# EAGLE design led_driver (EAGLE 6.5.0)
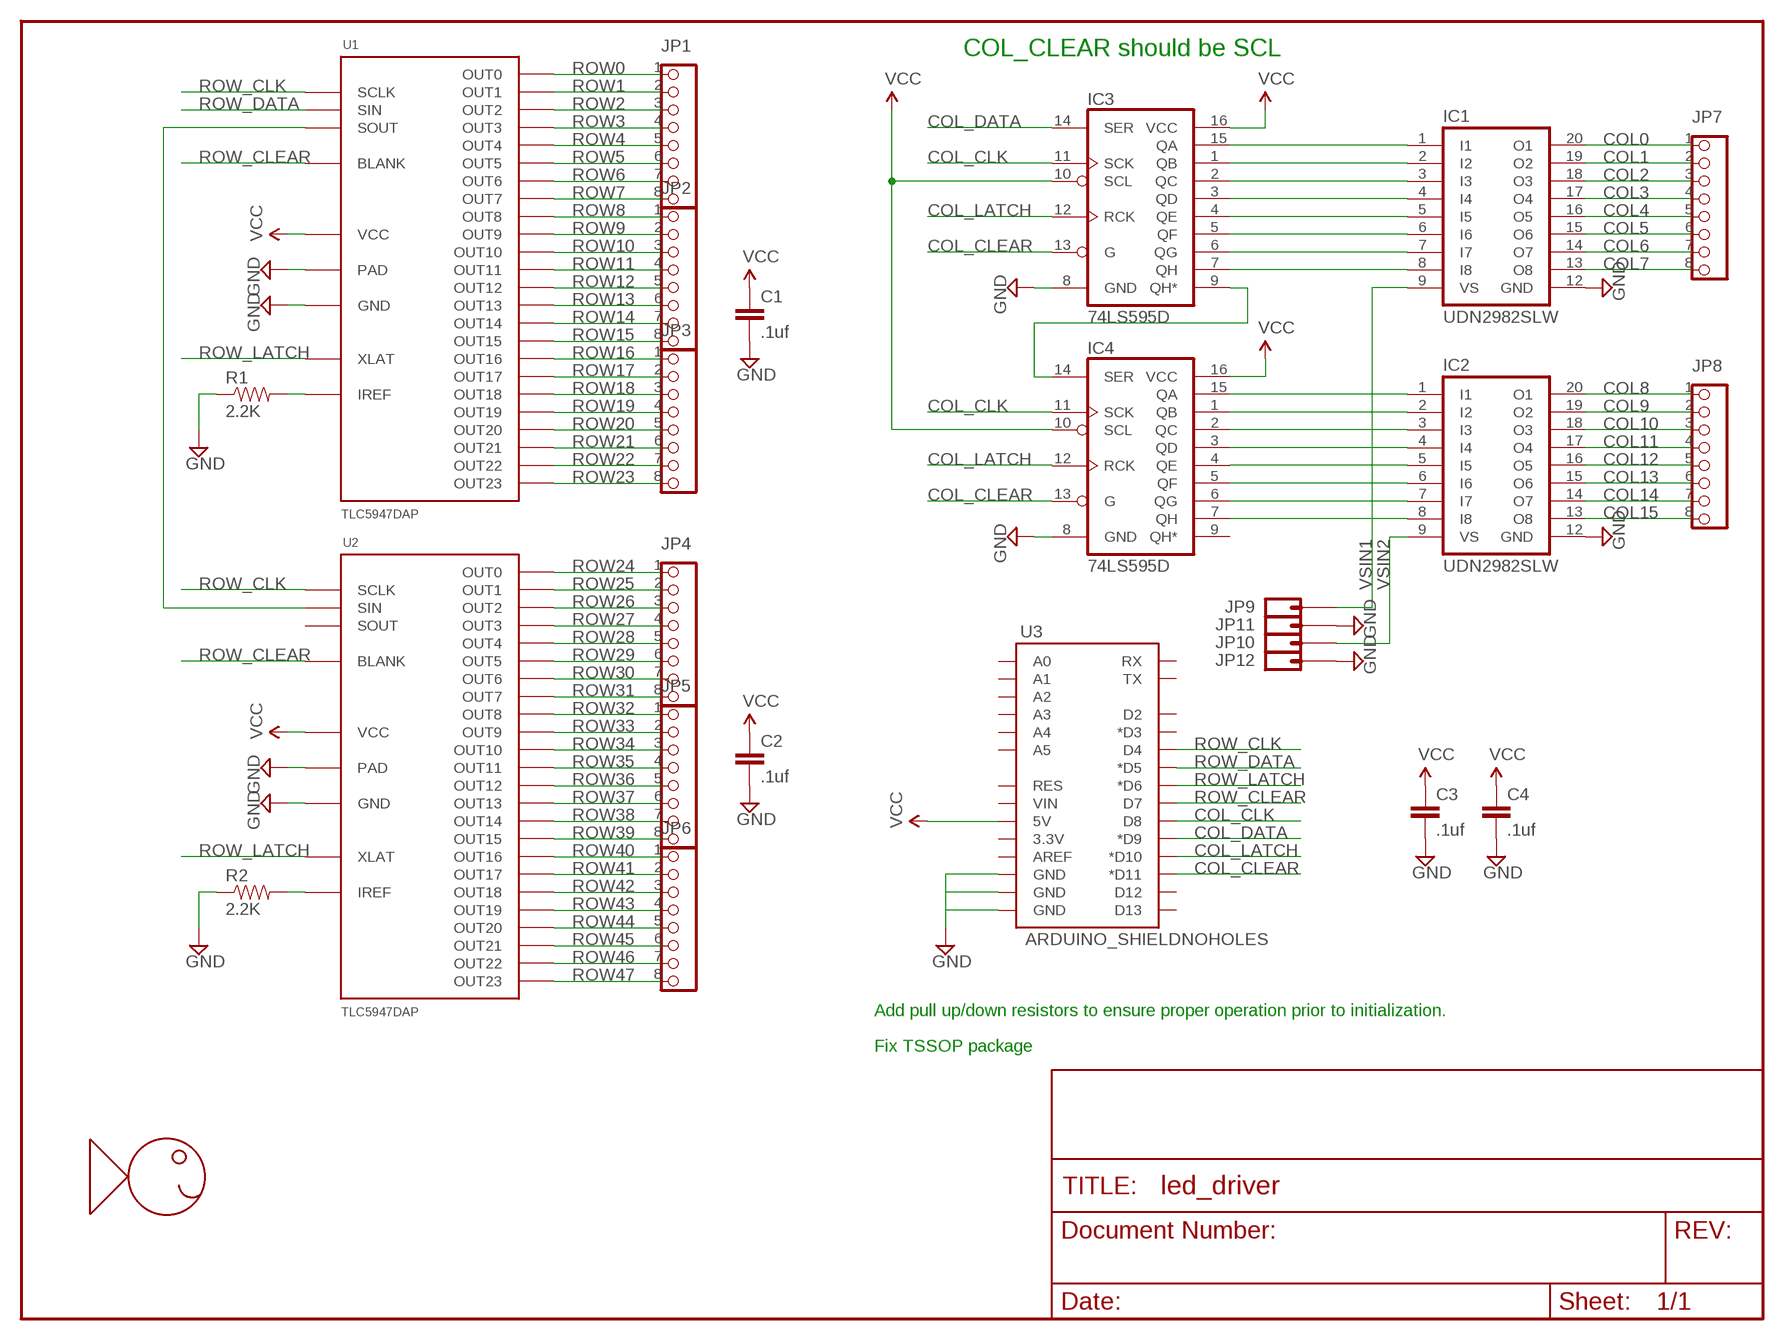
[diagram p0: schematic, sheet 1]

## Parts
C1  .1uf  CAP0603-CAP  [0603-CAP]
C2  .1uf  CAP0603-CAP  [0603-CAP]
C3  .1uf  CAP0603-CAP  [0603-CAP]
C4  .1uf  CAP0603-CAP  [0603-CAP]
IC1  UDN2982SLW  [SO20W]
IC2  UDN2982SLW  [SO20W]
IC3  74LS595D  [SO16]
IC4  74LS595D  [SO16]
JP1  PINHD-1X8  [1X08]
JP2  PINHD-1X8  [1X08]
JP3  PINHD-1X8  [1X08]
JP4  PINHD-1X8  [1X08]
JP5  PINHD-1X8  [1X08]
JP6  PINHD-1X8  [1X08]
JP7  PINHD-1X8  [1X08]
JP8  PINHD-1X8  [1X08]
JP9  HEADER_01PTH  [1X01]
JP10  HEADER_01PTH  [1X01]
JP11  HEADER_01PTH  [1X01]
JP12  HEADER_01PTH  [1X01]
R1  2.2K  RESISTOR0603-RES  [0603-RES]
R2  2.2K  RESISTOR0603-RES  [0603-RES]
U1  TLC5947DAP  [HTSSOP32DAP]
U2  TLC5947DAP  [HTSSOP32DAP]
U3  ARDUINO_SHIELDNOHOLES  [DUEMILANOVE_SHIELD_NOHOLES]
U$1  FHI_LOGO  [FHI_LOGO]

## Nets
COL0: IC1.20(O1) JP7.1
COL1: IC1.19(O2) JP7.2
COL2: IC1.18(O3) JP7.3
COL3: IC1.17(O4) JP7.4
COL4: IC1.16(O5) JP7.5
COL5: IC1.15(O6) JP7.6
COL6: IC1.14(O7) JP7.7
COL7: IC1.13(O8) JP7.8
COL8: IC2.20(O1) JP8.1
COL9: IC2.19(O2) JP8.2
COL10: IC2.18(O3) JP8.3
COL11: IC2.17(O4) JP8.4
COL12: IC2.16(O5) JP8.5
COL13: IC2.15(O6) JP8.6
COL14: IC2.14(O7) JP8.7
COL15: IC2.13(O8) JP8.8
COL_CLEAR: IC3.13(G) IC4.13(G) U3.D11(*D11)
COL_CLK: IC3.11(SCK) IC4.11(SCK) U3.D8
COL_DATA: IC3.14(SER) U3.D9(*D9)
COL_LATCH: IC3.12(RCK) IC4.12(RCK) U3.D10(*D10)
GND: C1.2 C2.2 C3.2 C4.2 IC1.12(GND) IC2.12(GND) IC3.8(GND) IC4.8(GND) JP11.1 JP12.1 R1.1 R2.1 U1.1(GND) U1.EXP(PAD) U2.1(GND) U2.EXP(PAD) U3.GND@0(GND) U3.GND@1(GND) U3.GND@2(GND)
N$1: IC1.1(I1) IC3.15(QA)
N$2: IC1.2(I2) IC3.1(QB)
N$3: IC1.3(I3) IC3.2(QC)
N$4: IC1.4(I4) IC3.3(QD)
N$5: IC1.5(I5) IC3.4(QE)
N$6: IC1.6(I6) IC3.5(QF)
N$7: IC1.7(I7) IC3.6(QG)
N$8: IC1.8(I8) IC3.7(QH)
N$9: IC3.9(QH*) IC4.14(SER)
N$10: IC2.1(I1) IC4.15(QA)
N$11: IC2.2(I2) IC4.1(QB)
N$12: IC2.3(I3) IC4.2(QC)
N$13: IC2.4(I4) IC4.3(QD)
N$14: IC2.5(I5) IC4.4(QE)
N$15: IC2.6(I6) IC4.5(QF)
N$16: IC2.7(I7) IC4.6(QG)
N$17: IC2.8(I8) IC4.7(QH)
N$28: R2.2 U2.31(IREF)
N$35: R1.2 U1.31(IREF)
N$38: U1.29(SOUT) U2.4(SIN)
ROW0: JP1.1 U1.5(OUT0)
ROW1: JP1.2 U1.6(OUT1)
ROW2: JP1.3 U1.7(OUT2)
ROW3: JP1.4 U1.8(OUT3)
ROW4: JP1.5 U1.9(OUT4)
ROW5: JP1.6 U1.10(OUT5)
ROW6: JP1.7 U1.11(OUT6)
ROW7: JP1.8 U1.12(OUT7)
ROW8: JP2.1 U1.13(OUT8)
ROW9: JP2.2 U1.14(OUT9)
ROW10: JP2.3 U1.15(OUT10)
ROW11: JP2.4 U1.16(OUT11)
ROW12: JP2.5 U1.17(OUT12)
ROW13: JP2.6 U1.18(OUT13)
ROW14: JP2.7 U1.19(OUT14)
ROW15: JP2.8 U1.20(OUT15)
ROW16: JP3.1 U1.21(OUT16)
ROW17: JP3.2 U1.22(OUT17)
ROW18: JP3.3 U1.23(OUT18)
ROW19: JP3.4 U1.24(OUT19)
ROW20: JP3.5 U1.25(OUT20)
ROW21: JP3.6 U1.26(OUT21)
ROW22: JP3.7 U1.27(OUT22)
ROW23: JP3.8 U1.28(OUT23)
ROW24: JP4.1 U2.5(OUT0)
ROW25: JP4.2 U2.6(OUT1)
ROW26: JP4.3 U2.7(OUT2)
ROW27: JP4.4 U2.8(OUT3)
ROW28: JP4.5 U2.9(OUT4)
ROW29: JP4.6 U2.10(OUT5)
ROW30: JP4.7 U2.11(OUT6)
ROW31: JP4.8 U2.12(OUT7)
ROW32: JP5.1 U2.13(OUT8)
ROW33: JP5.2 U2.14(OUT9)
ROW34: JP5.3 U2.15(OUT10)
ROW35: JP5.4 U2.16(OUT11)
ROW36: JP5.5 U2.17(OUT12)
ROW37: JP5.6 U2.18(OUT13)
ROW38: JP5.7 U2.19(OUT14)
ROW39: JP5.8 U2.20(OUT15)
ROW40: JP6.1 U2.21(OUT16)
ROW41: JP6.2 U2.22(OUT17)
ROW42: JP6.3 U2.23(OUT18)
ROW43: JP6.4 U2.24(OUT19)
ROW44: JP6.5 U2.25(OUT20)
ROW45: JP6.6 U2.26(OUT21)
ROW46: JP6.7 U2.27(OUT22)
ROW47: JP6.8 U2.28(OUT23)
ROW_CLEAR: U1.2(BLANK) U2.2(BLANK) U3.D7
ROW_CLK: U1.3(SCLK) U2.3(SCLK) U3.D4
ROW_DATA: U1.4(SIN) U3.D5(*D5)
ROW_LATCH: U1.30(XLAT) U2.30(XLAT) U3.D6(*D6)
VCC: C1.1 C2.1 C3.1 C4.1 IC3.10(SCL) IC3.16(VCC) IC4.10(SCL) IC4.16(VCC) U1.32(VCC) U2.32(VCC) U3.5V
VSIN1: IC1.9(VS) JP9.1
VSIN2: IC2.9(VS) JP10.1
Unconnected: IC4.9(QH*) U2.29(SOUT) U3.3.3V U3.A0 U3.A1 U3.A2 U3.A3 U3.A4 U3.A5 U3.AREF U3.D2 U3.D3(*D3) U3.D12 U3.D13 U3.RES U3.RX U3.TX U3.VIN

## Notes on the sheet
- COL_CLEAR should be SCL
- Add pull up/down resistors to ensure proper operation prior to initialization.
- Fix TSSOP package

## Library data of the parts
C1-C4 = SparkFun-Capacitors:CAP: Capacitor Standard 0603 ceramic capacitor, and 0.1" leaded capacitor.
IC1 IC2 = uln-udn:UDN298*: DRIVER ARRAY Source: Allegro Microsystems Inc. / UDN2981-UDN2984.pdf
IC3 IC4 = SparkFun-DigitalIC:74*595: 8-bit SHIFT REGISTER, output latch
JP1-JP8 = CyberRailGuru:PINHD-1X8: PIN HEADER
JP9-JP12 = CyberRailGuru:HEADER_01: Header 1 Standard 1-pin 0.1" header. Use with straight break away headers (SKU : PRT-00116), right angle break away headers (PRT-00553), swiss pins (PRT-00743), machine pins (PRT-00117), and female headers (PRT-00115).
R1 R2 = SparkFun-Resistors:RESISTOR: Resistor Basic schematic elements and footprints for 0603, 1206, and PTH resistors.
U1 U2 = CyberRailGuru:TLC5947
U3 = SparkFun-Boards:ARDUINO_SHIELD: Arduino shield footprint
U$1 = CyberRailGuru:FHI_LOGO: Fishhead Industries Logo

## Board
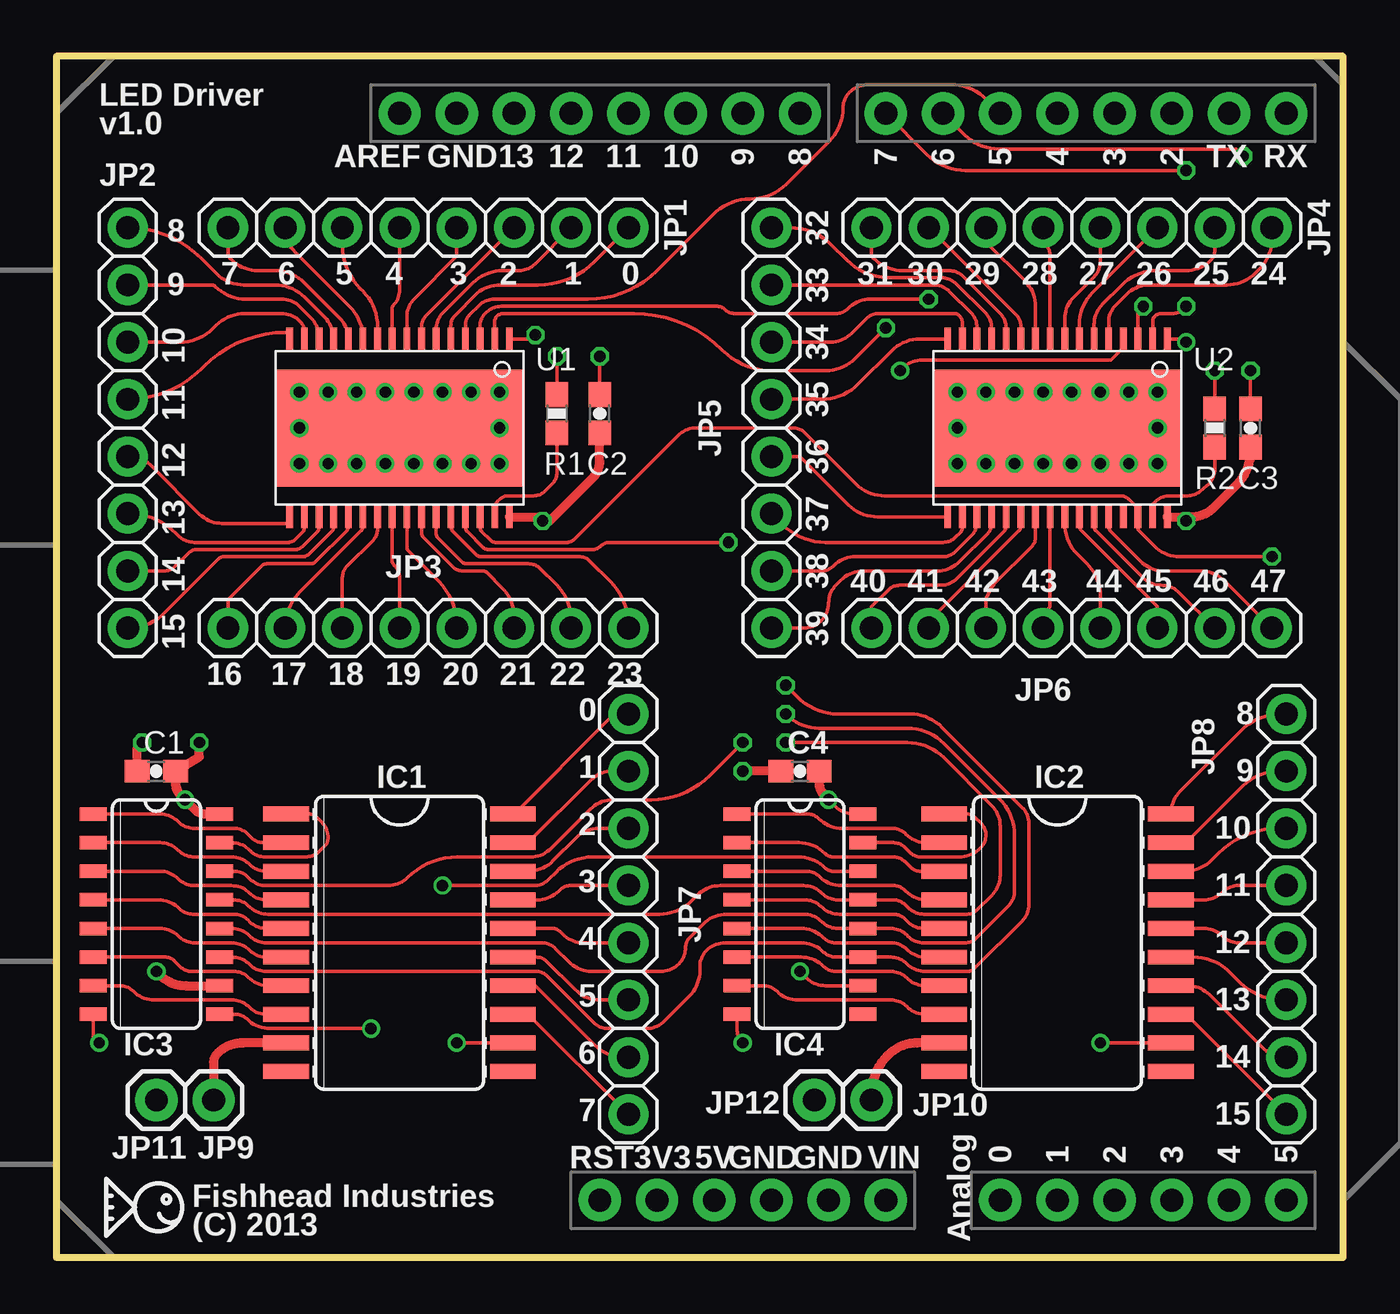
[diagram p1: board, top side]
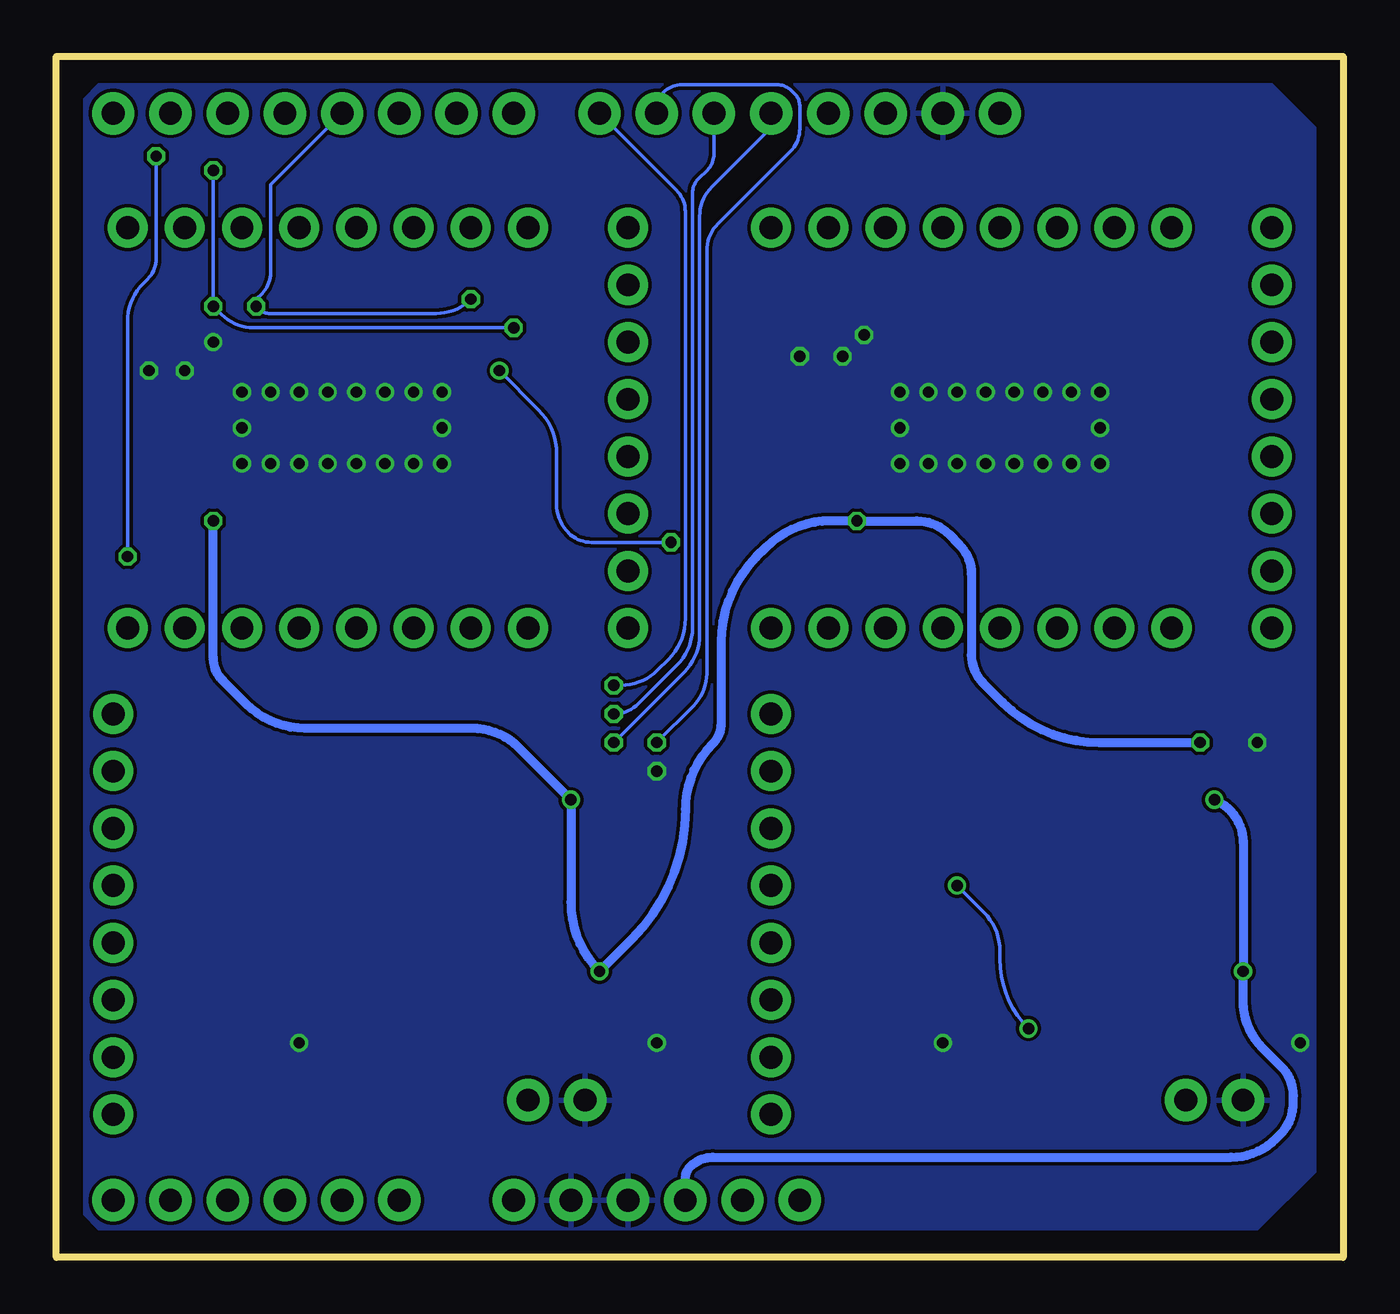
[diagram p2: board, bottom side, seen from below]

Size 57.14 x 53.33 mm. Coordinates in mm from the lower left corner, seen from the top.
Outline: 0,0 57.14,0 57.14,53.33 0,53.33 0,0
Copper layers (1*16): Top 0.035mm / dielectric 1.5mm / Bottom 0.035mm
Design rules "Fusion_eagle_rule_v1.1_tms *": minimum track width 6mil, minimum drill 12mil, track to track 6mil, track to pad 6mil, pad to pad 6mil, via to via 6mil, smd to smd 0mil, copper to edge 10mil, drill to drill 10mil, minimum pad ring 10mil, minimum via ring 6mil, stop-mask expansion 2mil, vias tented up to drill 100mil, thermal gap 10mil

### Footprints (pad centres in the part's own frame; a part is rotated, then mirrored left to right if it is on the bottom)
0603-CAP = smd 1.1 x 1: 1 -0.85,0; 2 0.85,0
SO20W = smd 0.66 x 2.032: 1 -5.715,-5.029; 2 -4.445,-5.029; 3 -3.175,-5.029; 4 -1.905,-5.029; 5 -0.635,-5.029; 6 0.635,-5.029; 7 1.905,-5.029; 8 3.175,-5.029; 9 4.445,-5.029; 10 5.715,-5.029; 11 5.715,5.029; 12 4.445,5.029; 13 3.175,5.029; 14 1.905,5.029; 15 0.635,5.029; 16 -0.635,5.029; 17 -1.905,5.029; 18 -3.175,5.029; 19 -4.445,5.029; 20 -5.715,5.029
SO16 = smd 0.6 x 1.2: 1 -4.445,-2.8; 2 -3.175,-2.8; 3 -1.905,-2.8; 4 -0.635,-2.8; 5 0.635,-2.8; 6 1.905,-2.8; 7 3.175,-2.8; 8 4.445,-2.8; 9 4.445,2.8; 10 3.175,2.8; 11 1.905,2.8; 12 0.635,2.8; 13 -0.635,2.8; 14 -1.905,2.8; 15 -3.175,2.8; 16 -4.445,2.8
1X08 = drill 1.016 pad 1.778: 1 -8.89,0; 2 -6.35,0; 3 -3.81,0; 4 -1.27,0; 5 1.27,0; 6 3.81,0; 7 6.35,0; 8 8.89,0
1X01 = drill 1.016 pad 1.88: 1 0,0
0603-RES = smd 1.1 x 1: 1 -0.85,0; 2 0.85,0
HTSSOP32DAP = smd 0.3 x 1: 1 -4.875,-3.95; 2 -4.225,-3.95; 3 -3.575,-3.95; 4 -2.925,-3.95; 5 -2.275,-3.95; 6 -1.625,-3.95; 7 -0.975,-3.95; 8 -0.325,-3.95; 9 0.325,-3.95; 10 0.975,-3.95; 11 1.625,-3.95; 12 2.275,-3.95; 13 2.925,-3.95; 14 3.575,-3.95; 15 4.225,-3.95; 16 4.875,-3.95; 17 4.875,3.95; 18 4.225,3.95; 19 3.575,3.95; 20 2.925,3.95; 21 2.275,3.95; 22 1.625,3.95; 23 0.975,3.95; 24 0.325,3.95; 25 -0.325,3.95; 26 -0.975,3.95; 27 -1.625,3.95; 28 -2.275,3.95; 29 -2.925,3.95; 30 -3.575,3.95; 31 -4.225,3.95; 32 -4.875,3.95 | smd 11 x 5.2: EXP 0,0
DUEMILANOVE_SHIELD_NOHOLES = drill 1.016 pad 1.88: 3.3V 50.8,26.67; 5V 50.8,29.21; A0 50.8,41.91; A1 50.8,44.45; A2 50.8,46.99; A3 50.8,49.53; A4 50.8,52.07; A5 50.8,54.61; AREF 2.54,15.24; D2 2.54,49.53; D3 2.54,46.99; D4 2.54,44.45; D5 2.54,41.91; D6 2.54,39.37; D7 2.54,36.83; D8 2.54,33.02; D9 2.54,30.48; D10 2.54,27.94; D11 2.54,25.4; D12 2.54,22.86; D13 2.54,20.32; GND@0 50.8,31.75; GND@1 50.8,34.29; GND@2 2.54,17.78; RES 50.8,24.13; RX 2.54,54.61; TX 2.54,52.07; VIN 50.8,36.83

### Placement (x,y rotation side)
C1  4.45,21.59 180 top
C2  24.13,37.47 90 top
C3  53.02,36.83 90 top
C4  33.02,21.59 180 top
IC1  15.24,13.97 270 top
IC2  44.45,13.97 270 top
IC3  4.45,15.24 270 top
IC4  33.02,15.24 270 top
JP1  16.51,45.72 180 top
JP2  3.17,36.83 270 top
JP3  16.51,27.94 0 top
JP4  45.09,45.72 180 top
JP5  31.75,36.83 270 top
JP6  45.09,27.94 0 top
JP7  25.4,15.24 270 top
JP8  54.61,15.24 270 top
JP9  6.99,6.99 0 top
JP10  36.2,6.99 0 top
JP11  4.45,6.99 0 top
JP12  33.66,6.99 0 top
R1  22.23,37.47 270 top
R2  51.44,36.83 270 top
U1  15.24,36.83 180 top
U2  44.45,36.83 180 top
U3  0,53.34 270 top
U$1  3.49,2.22 0 top

### Tracks (layer width: path | path; a pad name or v marks a point on that pad's centre or on a via)
COL0
  Top 0.152: IC1.20 20.27,19.63 24.56,23.92 arc-45 25.06,24.13 JP7.1
COL1
  Top 0.152: IC1.19 20.95,18.41 23.73,21.2 arc-45 24.69,21.59 JP7.2
COL2
  Top 0.152: IC1.18 20.92,17.14 arc45 22.06,17.62 23.08,18.63 arc-45 24.08,19.05 JP7.3
COL3
  Top 0.152: IC1.17 21.36,15.88 arc45 22.29,16.26 22.34,16.3 arc-45 22.84,16.51 JP7.4
COL4
  Top 0.152: IC1.16 22.04,14.61 arc-45 22.36,14.47 22.48,14.35 arc45 23.4,13.97 JP7.5
COL5
  Top 0.152: IC1.15 21.3,13.34 arc-45 21.8,13.13 23.03,11.89 arc45 24.15,11.43 JP7.6
COL6
  Top 0.152: IC1.14 21.27,12.06 23.91,9.43 arc45 25.21,8.89 JP7.7
COL7
  Top 0.152: IC1.13 20.95,10.79 JP7.8
COL8
  Top 0.152: IC2.20 arc-45 49.89,20.68 52.61,23.4 arc-45 54.37,24.13 JP8.1
COL9
  Top 0.152: IC2.19 50.16,18.41 52.68,20.93 arc-45 54.27,21.59 JP8.2
COL10
  Top 0.152: IC2.18 50.09,17.14 arc45 51.3,17.65 51.59,17.93 arc-45 54.29,19.05 JP8.3
COL11
  Top 0.152: IC2.17 50.95,15.88 arc45 51.78,16.22 arc-45 52.49,16.51 JP8.4
COL12
  Top 0.152: IC2.16 50.96,14.61 arc-45 51.77,14.27 arc45 52.49,13.97 JP8.5
COL13
  Top 0.152: IC2.15 50.48,13.34 arc-45 52.11,12.66 52.57,12.2 arc45 54.42,11.43 JP8.6
COL14
  Top 0.152: IC2.14 50.24,12.06 arc-45 51.2,11.67 53.53,9.34 arc45 JP8.7
COL15
  Top 0.152: IC2.13 50.16,10.79 JP8.8
COL_CLEAR  (via drill 0.5)
  Top 0.152: IC3.13 7.88,15.88 arc-45 8.52,15.61 arc45 9.42,15.24 26.79,15.24 arc45 28.21,15.83 28.48,16.09 arc-45 29.48,16.51 33.17,16.51 arc-45 34,16.17 arc45 34.71,15.88 IC4.13 37.17,15.88 arc-45 37.67,15.67 37.81,15.53 arc45 38.52,15.24 40.43,15.24 arc45 40.88,15.43 41.54,16.08 arc45 41.91,16.98 41.91,19.14 arc45 41.53,20.07 39.41,22.19 arc45 37.79,22.86 v32.38,22.86
  Bottom 0.152: U3.D11 25.4,50.16 28.03,47.53 arc-45 28.57,46.22 28.57,27.63 arc45 29.25,25.99 v32.38,22.86
COL_CLK  (via drill 0.5)
  Top 0.152: IC3.11 7.78,13.34 arc-45 8.59,13 arc45 9.31,12.7 21.3,12.7 arc-45 21.8,12.49 23.87,10.42 arc45 24.5,10.16 26.2,10.16 arc45 27,10.49 28.1,11.59 arc45 28.57,12.74 28.57,12.92 arc-45 28.87,13.63 arc-45 29.69,13.97 33.07,13.97 arc-45 34.07,13.55 arc45 34.6,13.34 IC4.11 37.05,13.34 arc-45 37.76,13.04 arc45 38.58,12.7 40.45,12.7 arc45 40.77,12.83 42.89,14.95 arc45 43.18,15.66 43.18,19.29 arc45 42.9,19.96 39.33,23.54 arc45 37.89,24.13 34.72,24.13 arc-45 32.91,24.88 v32.38,25.4
  Bottom 0.152: v32.38,25.4 32.06,25.4 arc-45 30.44,26.07 29.96,26.55 arc-45 29.21,28.36 29.21,46.43 arc-45 29.61,47.38 U3.D8
COL_DATA  (via drill 0.5)
  Top 0.152: IC3.14 7.88,17.14 arc-45 8.52,16.88 8.6,16.8 arc45 9.31,16.51 14.74,16.51 arc45 15.59,16.86 arc-45 17.8,17.78 21.05,17.78 arc45 21.97,18.16 23.71,19.9 arc-45 24.72,20.32 26.41,20.32 arc45 29.02,21.4 v30.48,22.86
  Bottom 0.152: U3.D9 30.48,51.14 arc45 30.27,51.64 30.18,51.73 arc45 29.37,52.07 25.14,52.07 arc45 24.5,51.81 24.34,51.64 arc45 24.13,51.14 24.13,50.12 arc45 24.55,49.11 27.76,45.9 arc-45 28.26,44.69 28.26,25.91 arc45 28.85,24.49 v30.48,22.86
COL_LATCH  (via drill 0.5)
  Top 0.152: IC3.12 7.78,14.61 arc-45 8.59,14.27 arc45 9.31,13.97 21.54,13.97 arc-45 22.17,13.71 22.76,13.12 arc45 23.77,12.7 26.83,12.7 arc45 27.64,13.04 arc45 27.94,13.76 arc-45 28.13,14.21 28.73,14.81 arc-45 29.76,15.24 33.18,15.24 arc-45 33.99,14.9 arc45 34.71,14.61 IC4.12 37.05,14.61 arc-45 37.76,14.31 37.81,14.26 arc45 38.52,13.97 40.35,13.97 arc45 40.85,14.18 42.25,15.58 arc45 42.55,16.29 42.55,18.75 arc45 41.89,20.34 39.41,22.82 arc45 37.79,23.5 33.85,23.5 arc-45 32.43,24.08 v32.38,24.13
  Bottom 0.152: U3.D10 27.94,48.99 arc45 28.23,48.28 28.63,47.89 arc-45 28.89,47.25 28.89,27.95 arc45 29.57,26.31 31.3,24.58 arc45 v32.38,24.13
GND  (via drill 0.5)
  Top 0.152: U2.1 50.02,40.78 v50.16,40.64 | IC2.12 v46.35,9.53 | IC4.8 30.22,10.15 arc45 v30.48,9.53 | IC1.12 v17.78,9.53 | IC3.8 1.65,9.79 v1.91,9.53 | U1.1 21.09,40.78 v21.27,40.96 | R1.1 v22.23,40.01 | R2.1 v51.44,39.37 | C3.2 v53.02,39.37 | C2.2 v24.13,40.01
  Top 0.406: C1.2 3.6,22.64 v3.81,22.86 | C4.2 v30.48,21.59 | U2.EXP v48.9,36.83
  Top 0.813: U1.EXP v19.68,36.83 | U2.EXP v48.9,36.83
  other vias: 10.79,38.42 12.06,38.42 18.41,35.24 13.34,38.42 14.61,38.42 13.34,35.24 10.79,35.24 15.88,35.24 15.88,38.42 17.14,38.42 18.41,38.42 12.06,35.24 14.61,35.24 17.14,35.24 19.68,35.24 19.68,38.42 10.79,36.83 40.01,38.42 41.27,38.42 47.62,35.24 42.55,38.42 43.81,38.42 42.55,35.24 40.01,35.24 45.09,35.24 45.09,38.42 46.35,38.42 47.62,38.42 41.27,35.24 43.81,35.24 46.35,35.24 48.9,35.24 48.9,38.42 40.01,36.83
  pour Bottom: 1.27,3.81 3.81,1.27 55.24,1.27 55.88,1.91 55.88,51.44 55.24,52.07 3.17,52.07 1.27,50.16
N$1
  Top 0.152: IC3.15 7.78,18.41 arc-45 8.59,18.08 8.63,18.04 arc45 9.26,17.78 11.06,17.78 arc45 11.69,18.04 11.91,18.26 arc45 12.06,18.63 arc45 11.77,19.34 11.56,19.55 arc45 11.24,19.68 IC1.1
N$2
  Top 0.152: IC3.1 4.61,19.68 arc-45 5.42,19.35 arc45 6.14,19.05 7.88,19.05 arc-45 8.52,18.79 8.68,18.62 arc45 9.18,18.41 IC1.2
N$3
  Top 0.152: IC3.2 4.61,18.41 arc-45 5.42,18.08 5.42,18.07 arc45 6.13,17.78 7.77,17.78 arc-45 8.6,17.44 arc45 9.31,17.14 IC1.3
N$4
  Top 0.152: IC3.3 4.61,17.14 arc-45 5.42,16.81 arc45 6.14,16.51 7.77,16.51 arc-45 8.6,16.17 arc45 9.31,15.88 IC1.4
N$5
  Top 0.152: IC3.4 4.52,15.88 arc-45 5.47,15.48 arc45 6.05,15.24 7.88,15.24 arc-45 8.52,14.98 8.6,14.9 arc45 9.31,14.61 IC1.5
N$6
  Top 0.152: IC3.5 4.61,14.61 arc-45 5.42,14.27 arc45 6.14,13.97 7.77,13.97 arc-45 8.6,13.63 arc45 9.31,13.34 IC1.6
N$7
  Top 0.152: IC3.6 4.82,13.34 arc-45 5.27,13.15 5.51,12.91 arc45 6.01,12.7 7.88,12.7 arc-45 8.52,12.44 arc45 9.42,12.06 IC1.7
N$8
  Top 0.152: IC3.7 2.82,12.06 arc-45 3.43,11.81 arc45 4.35,11.43 7.78,11.43 arc-45 8.59,11.1 arc45 9.31,10.79 IC1.8
N$9  (via drill 0.5)
  Top 0.152: IC4.14 34.48,17.14 arc-45 34.16,17.28 arc45 32.95,17.78 23.82,17.78 arc45 22.18,17.1 21.85,16.77 arc-45 21.22,16.51 v17.14,16.51 | IC3.9 7.96,10.79 arc-45 8.46,10.59 arc45 9.49,10.16 v13.97,10.16
  Bottom 0.152: v17.14,16.51 15.95,15.31 arc45 15.24,13.6 15.24,13.23 arc-45 v13.97,10.16
N$10
  Top 0.152: IC4.15 37.17,18.41 arc-45 37.67,18.21 37.89,17.99 arc45 38.39,17.78 40.08,17.78 arc45 41.03,18.17 arc45 41.27,18.76 arc45 41.07,19.26 40.77,19.55 arc45 40.45,19.68 IC2.1
N$11
  Top 0.152: IC4.1 33.36,19.68 arc-45 33.86,19.48 arc45 34.89,19.05 37.09,19.05 arc-45 37.73,18.79 arc45 38.63,18.41 IC2.2
N$12
  Top 0.152: IC4.2 32.98,18.41 arc-45 34.13,17.94 arc45 34.52,17.78 37.17,17.78 arc-45 37.67,17.57 37.89,17.35 arc45 38.39,17.14 IC2.3
N$13
  Top 0.152: IC4.3 33.3,17.14 arc-45 33.91,16.89 arc45 34.83,16.51 37.17,16.51 arc-45 37.67,16.3 37.72,16.26 arc45 38.64,15.88 IC2.4
N$14
  Top 0.152: IC4.4 33.23,15.88 arc-45 33.95,15.57 arc45 34.76,15.24 37.17,15.24 arc-45 37.67,15.03 37.81,14.9 arc45 38.52,14.61 IC2.5
N$15
  Top 0.152: IC4.5 33.07,14.61 arc-45 34.07,14.19 arc45 34.6,13.97 37.05,13.97 arc-45 37.76,13.68 arc45 38.58,13.34 IC2.6
N$16
  Top 0.152: IC4.6 33.07,13.34 arc-45 34.07,12.92 arc45 34.6,12.7 37.05,12.7 arc-45 37.76,12.41 arc45 38.58,12.06 IC2.7
N$17
  Top 0.152: IC4.7 31.38,12.06 arc-45 32.01,11.8 arc45 32.91,11.43 37.05,11.43 arc-45 37.76,11.14 arc45 38.58,10.79 IC2.8
N$28
  Top 0.152: U2.31 48.67,33.34 arc-45 48.74,33.51 48.78,33.54 arc-45 49.44,33.81 50.22,33.81 arc39 50.78,34.01 51.09,34.27 arc51 51.44,35 R2.2
N$35
  Top 0.152: U1.31 19.46,33.24 arc-45 19.6,33.57 19.7,33.67 arc-45 20.05,33.81 21.19,33.81 arc45 21.7,34.02 22.01,34.34 arc45 22.23,34.86 R1.2
N$38  (via drill 0.5)
  Top 0.152: U2.4 47.38,40.39 46.83,39.85 38.44,39.85 arc45 37.59,39.49 v37.47,39.37 | 18.16,33.27 U1.29 18.16,32.42 arc45 18.24,32.24 18.96,31.52 arc45 19.18,31.43 23.8,31.43 arc45 24.2,31.6 arc-45 24.57,31.75 v29.84,31.75
  Bottom 0.152: v37.47,39.37 35.73,37.63 arc45 34.92,35.7 34.92,33.45 arc-45 34.4,32.18 34.39,32.17 arc-45 33.38,31.75 v29.84,31.75
ROW0
  Top 0.152: U1.5 17.52,41.36 arc-45 17.72,41.85 18.59,42.72 arc-45 19.71,43.18 21.39,43.18 arc45 23.9,44.22 JP1.1
ROW1
  Top 0.152: U1.6 16.86,41.22 arc-45 17.15,41.92 18.51,43.27 arc-45 19.82,43.81 20.54,43.81 arc45 21.25,44.11 JP1.2
ROW2
  Top 0.152: U1.7 16.21,41.33 arc-45 16.42,41.82 JP1.3
ROW3
  Top 0.152: U1.8 15.56,41.76 arc-45 15.9,42.57 17.78,44.45 JP1.4
ROW4
  Top 0.152: U1.9 14.91,42.18 arc-45 14.95,42.25 arc45 15.24,42.96 JP1.5
ROW5
  Top 0.152: U1.10 14.27,41.33 arc45 13.61,42.9 13.5,43.02 arc-45 12.7,44.95 JP1.6
ROW6
  Top 0.152: U1.11 13.62,40.81 arc45 13.03,42.21 10.61,44.64 arc-45 JP1.7
ROW7
  Top 0.152: U1.12 arc45 12.58,41.72 11,43.29 arc45 9.73,43.81 8.96,43.81 arc-45 7.75,44.32 arc-45 7.62,44.64 JP1.8
ROW8
  Top 0.152: U1.13 arc45 11.92,41.74 11.02,42.64 arc45 9.71,43.18 8.33,43.18 arc-45 7.12,43.68 6.43,44.37 arc45 JP2.1
ROW9
  Top 0.152: U1.14 11.66,40.84 arc45 11.3,41.73 10.81,42.21 arc45 10,42.55 8.42,42.55 arc-45 7.05,43.11 arc45 6.89,43.18 JP2.2
ROW10
  Top 0.152: JP2.3 5.51,40.64 arc45 6.95,41.23 7.09,41.38 arc-45 8.36,41.91 10,41.91 arc-45 10.81,41.58 arc-45 11.02,41.09 U1.15
ROW11
  Top 0.152: U1.16 10.37,41.07 10.19,41.07 arc45 6.54,39.56 6.43,39.45 arc-45 JP2.4
ROW12
  Top 0.152: U1.17 10.37,32.59 7.35,32.59 arc-45 6.38,32.99 4.26,35.11 arc45 JP2.5
ROW13
  Top 0.152: U1.18 11.02,32.39 arc-45 10.95,32.22 10.61,31.88 arc-45 10.29,31.75 6.13,31.75 arc-45 5.42,32.04 5.32,32.14 arc45 3.2,33.02 JP2.6
ROW14
  Top 0.152: U1.19 11.66,32.41 arc-45 11.59,32.23 10.93,31.56 arc-45 10.61,31.43 6.22,31.43 arc45 5.9,31.3 5.29,30.69 arc-45 4.79,30.48 JP2.7
ROW15
  Top 0.152: U1.20 12.31,32.42 arc-45 12.24,32.24 11.43,31.43 11.24,31.25 arc-45 10.93,31.11 7.43,31.11 arc45 7.21,31.02 4.8,28.61 arc-45 JP2.8
ROW16
  Top 0.152: U1.21 12.96,32.44 arc-45 12.89,32.25 11.52,30.89 arc-45 11.3,30.8 9.34,30.8 arc45 9.12,30.7 7.62,29.21 JP3.1
ROW17
  Top 0.152: JP3.2 arc-45 10.83,29.57 13.53,32.27 arc45 13.62,32.47 U1.22
ROW18
  Top 0.152: U1.23 14.27,32.34 arc-45 14.06,31.84 12.91,30.69 arc45 12.7,30.19 JP3.3
ROW19
  Top 0.152: U1.24 14.91,30.94 arc45 15.01,30.71 15.05,30.67 arc-45 15.24,30.22 JP3.4
ROW20
  Top 0.152: JP3.5 17.78,28.09 arc45 16.98,30 15.66,31.33 arc-45 15.56,31.55 U1.25
ROW21
  Top 0.152: JP3.6 20.32,28.44 arc45 19.78,29.75 19.14,30.39 arc45 18.92,30.48 18.07,30.48 arc-45 17.57,30.69 16.3,31.96 arc-45 16.21,32.17 U1.26
ROW22
  Top 0.152: JP3.7 22.86,28.28 arc45 22.2,29.87 21.48,30.59 arc45 20.98,30.8 18.23,30.8 arc-45 18,30.89 16.95,31.95 arc-45 16.86,32.15 U1.27
ROW23
  Top 0.152: U1.28 17.52,32.44 arc45 17.59,32.25 18.64,31.21 arc45 18.86,31.11 23.2,31.11 arc-45 23.7,30.91 24.6,30.01 arc-45 25.4,28.08 JP3.8
ROW24
  Top 0.152: JP4.1 53.98,45.19 arc-45 53.45,43.92 53.23,43.71 arc-45 51.96,43.18 48.53,43.18 arc45 47.53,42.76 47.01,42.25 arc45 46.73,41.56 U2.5
ROW25
  Top 0.152: JP4.2 51.44,44.69 arc-45 51.27,44.28 arc-45 50.14,43.81 48.87,43.81 arc45 47.28,43.16 46.45,42.32 arc45 46.08,41.42 U2.6
ROW26
  Top 0.152: U2.7 45.42,41.42 arc-45 46.01,42.83 JP4.3
ROW27
  Top 0.152: U2.8 44.77,41.68 arc-45 45.17,42.63 46.06,43.52 arc45 46.35,44.23 JP4.4
ROW28
  Top 0.152: U2.9 44.12,44.48 arc45 43.92,44.98 arc-45 43.81,45.23 JP4.5
ROW29
  Top 0.152: JP4.6 41.27,45.09 43.02,43.34 arc-45 43.48,42.24 U2.10
ROW30
  Top 0.152: U2.11 42.83,41.38 arc45 42.65,41.8 JP4.7
ROW31
  Top 0.152: U2.12 42.17,41.27 arc45 41.91,41.91 40.27,43.55 arc45 39.63,43.81 37.6,43.81 arc-45 36.29,44.36 arc-45 36.2,44.58 JP4.8
ROW32
  Top 0.152: U2.13 41.52,41.29 arc45 41.27,41.92 39.95,43.23 arc45 39.32,43.5 37.01,43.5 arc-45 35.08,44.3 34.41,44.97 arc45 32.59,45.72 JP5.1
ROW33
  Top 0.152: JP5.2 38.95,43.18 arc-45 39.66,42.89 40.62,41.93 arc-45 40.88,41.31 U2.14
ROW34
  Top 0.152: JP5.3 34.38,40.64 arc45 35.31,41.02 35.99,41.7 arc-45 36.49,41.91 39.87,41.91 arc-45 40.1,41.82 arc-45 40.23,41.51 U2.15
ROW35
  Top 0.152: U2.16 38.36,40.78 arc45 37.07,40.25 35.6,38.78 arc-45 33.97,38.1 JP5.4
ROW36
  Top 0.152: JP5.5 33.02,35.56 35.17,33.41 arc45 36.45,32.88 U2.17
ROW37
  Top 0.152: U2.18 40.23,32.39 arc-45 40.16,32.22 39.9,31.96 arc-45 39.39,31.75 34.14,31.75 arc-45 32.23,32.55 JP5.6
ROW38
  Top 0.152: U2.19 40.88,32.59 arc-45 40.67,32.1 39.9,31.32 arc-45 39.39,31.11 35.48,31.11 arc45 34.53,30.72 arc-45 33.95,30.48 JP5.7
ROW39
  Top 0.152: U2.20 41.52,32.55 arc-45 41.36,32.15 40.1,30.9 arc-45 39.1,30.48 35.83,30.48 arc45 34.83,30.06 34.62,29.86 arc45 34.29,29.05 arc-90 33.18,27.94 JP5.8
ROW40
  Top 0.152: U2.21 42.17,32.44 arc-45 42.1,32.25 39.98,30.14 arc-45 39.27,29.84 37.44,29.84 arc45 36.94,29.64 36.2,28.89 JP6.1
ROW41
  Top 0.152: U2.22 42.83,32.47 arc-45 42.74,32.27 39.05,28.57 39.05,28.26 JP6.2
ROW42
  Top 0.152: JP6.3 41.27,29.2 arc-29 41.32,29.36 41.55,29.76 arc-16 41.66,29.91 43.3,31.55 arc45 43.48,31.98 U2.23
ROW43
  Top 0.152: U2.24 44.12,28.89 43.81,28.57 JP6.4
ROW44
  Top 0.152: JP6.5 46.35,29.36 arc45 45.75,30.81 45.34,31.23 arc-45 44.77,32.58 U2.25
ROW45
  Top 0.152: U2.26 45.42,32.48 arc45 45.51,32.28 48.9,28.89 JP6.6 48.9,28.26
ROW46
  Top 0.152: JP6.7 49.87,29.51 arc45 49.05,29.84 arc-45 48.24,30.18 46.16,32.27 arc-45 46.08,32.47 U2.27
ROW47
  Top 0.152: U2.28 46.73,32.44 arc45 46.8,32.25 48.16,30.9 arc45 49.17,30.48 50.78,30.48 arc-45 51.9,30.02 JP6.8
ROW_CLEAR  (via drill 0.5)
  Top 0.152: U2.2 48.67,41.56 arc-45 48.76,41.78 arc-45 49.08,41.91 49.55,41.91 arc45 50.05,42.12 v50.16,42.23 | v50.16,48.26 40.37,48.26 arc-45 38.66,48.97 U3.D7 | U1.2 19.46,41.56 arc-45 19.55,41.78 arc-45 19.87,41.91 25.64,41.91 arc-45 29.57,40.28 arc45 31.77,39.37 34.16,39.37 arc45 35.47,39.91 v36.83,41.27
  Bottom 0.152: v50.16,48.26 v50.16,42.23 49.8,41.86 arc-45 48.38,41.27 v36.83,41.27
ROW_CLK  (via drill 0.5)
  Top 0.152: U2.3 48.02,41.99 v48.26,42.23 | U1.3 18.82,41.39 arc-45 19.02,41.88 19.1,41.96 arc-45 19.74,42.23 29.37,42.23 arc-45 29.64,42.12 arc45 30.14,41.91 34.62,41.91 arc45 35.14,42.13 arc-45 36.15,42.55 v38.73,42.55
  Bottom 0.152: U3.D4 47.62,47.62 47.62,43.72 arc45 48.01,42.8 48.26,42.55 v48.26,42.23 48.15,42.12 arc-45 47.65,41.91 40.27,41.91 arc-45 v38.73,42.55
ROW_DATA
  Top 0.152: U1.4 18.16,41.42 arc-45 18.33,41.83 18.79,42.28 arc-45 19.42,42.55 23.61,42.55 arc45 26.66,43.81 29.17,46.31 arc-45 30.8,46.99 arc45 32.42,47.66 34.32,49.56 arc45 34.92,51.02 arc-45 35.22,51.73 35.23,51.73 arc-45 36.03,52.07 39.71,52.07 arc-45 41.3,51.41 U3.D5
ROW_LATCH  (via drill 0.5)
  Top 0.152: U1.30 18.82,32.41 arc45 18.89,32.23 19.27,31.84 arc45 19.5,31.75 22.67,31.75 arc45 22.99,31.88 27.61,36.49 arc-45 28.41,36.83 32.73,36.83 arc-45 33.23,36.62 35.51,34.34 arc45 36.79,33.81 47.26,33.81 arc-45 47.61,33.67 48.02,33.26 U2.30 48.02,32.41 arc45 48.1,32.23 48.75,31.58 arc45 49.87,31.11 v53.98,31.11 | U3.D6 40.33,49.84 arc45 41.84,49.21 52.39,49.21 v52.7,48.9
  Bottom 0.152: v53.98,31.11 53.98,41.54 arc45 53.27,43.25 53.08,43.44 arc-45 52.7,44.34 v52.7,48.9
VCC  (via drill 0.5)
  Top 0.152: IC4.16 35.4,19.68 arc-45 34.59,20.02 v34.29,20.32 | v33.02,12.7 33.32,12.4 arc45 34.13,12.06 IC4.10
  Top 0.406: IC3.16 6.61,19.68 arc-45 6.16,19.87 v5.71,20.32 5.52,20.52 arc-45 5.29,21.06 C1.1 6.35,22.23 v6.35,22.86 | v4.45,12.7 4.61,12.54 arc45 5.75,12.06 IC3.10 | U1.32 21.45,32.88 v21.59,32.7 21.91,32.7 23.84,34.63 arc45 24.13,35.34 C2.1 | U2.32 49.99,32.88 | 49.99,32.88 v50.16,32.7 | 49.99,32.88 50.39,32.88 arc45 51.39,33.3 52.43,34.34 arc45 53.02,35.76 C3.1 | C4.1 33.87,21.06 arc45 34.09,20.52 v34.29,20.32
  Bottom 0.406: v5.71,20.32 5.57,20.25 arc63 4.45,18.43 v4.45,12.7 4.45,11.41 arc-45 3.56,9.28 2.64,8.35 arc45 2.22,7.03 arc45 2.71,5.55 2.98,5.28 arc45 4.99,4.45 27.99,4.45 arc-45 28.99,4.03 arc-45 29.21,3.5 U3.5V | v50.16,32.7 50.16,26.62 arc-45 49.75,25.62 48.71,24.58 arc-45 46.09,23.5 38.68,23.5 arc45 36.61,22.64 v34.29,20.32 34.29,15.77 arc-45 v33.02,12.7 31.6,14.12 arc-45 29.21,19.89 arc45 28.01,22.79 arc-45 27.62,23.72 27.62,27.32 arc45 26.06,31.09 25.63,31.52 arc45 22.77,32.7 v21.59,32.7 18.94,32.7 arc45 17.5,32.11 17.05,31.66 arc45 16.51,30.35 16.51,26.74 arc-45 16.01,25.53 15.12,24.65 arc-45 10.81,22.86 v6.35,22.86
VSIN1
  Top 0.406: IC1.9 8.29,9.53 arc45 7.15,9.05 arc45 6.99,8.66 JP9.1
VSIN2
  Top 0.406: IC2.9 38.23,9.53 arc45 36.92,8.98 36.9,8.96 arc45 36.2,7.25 JP10.1

### Text on the board
tNames: LED Driver | v1.0 | 8 | 32 | 9 | 7 | 6 | 5 | 4 | 3 | 2 | 1 | 0 | 31 | 30 | 29 | 28 | 27 | 26 | 25 | 24 | 33 | 10 | 34 | 11 | 35 | 12 | 36 | 13 | 37 | 14 | 38 | 40 | 41 | 42 | 43 | 44 | 45 | 46 | 47 | 15 | 39 | 16 | 17 | 18 | 19 | 20 | 21 | 22 | 23 | 0 | 8 | 1 | 9 | 2 | 10 | 3 | 11 | 4 | 12 | 5 | 13 | 6 | 14 | 7 | 15 | Fishhead Industries | (C) 2013